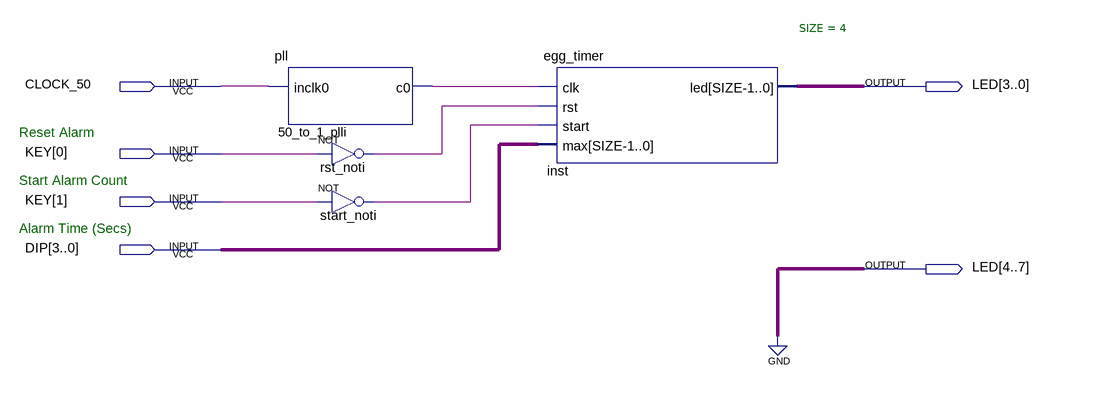
[diagram p0: schematic sheet]
// Quartus schematic toplevel.bdf as structural Verilog: 4 symbols, 6 pins
module toplevel (
  input  CLOCK_50,
  input  [1:0] KEY,
  input  [3:0] DIP,
  output [0:7] LED
);

  wire n50_to_1_plli_c0, rst_noti_out, start_noti_out;

  pll u_50_to_1_plli (.inclk0(CLOCK_50), .c0(n50_to_1_plli_c0));
  not rst_noti (rst_noti_out, KEY[0]);
  not start_noti (start_noti_out, KEY[1]);
  egg_timer #(.SIZE(4)) inst (
    .clk(n50_to_1_plli_c0), .rst(rst_noti_out), .start(start_noti_out), .max(DIP),
    .led({LED[3], LED[2], LED[1], LED[0]}));

  assign LED[4:7] = 4'b0000;

  // Notes on the sheet:
  //   Reset Alarm
  //   Start Alarm Count
  //   Alarm Time (Secs)
endmodule
